# Altium schematic sheet Mixer.SchDoc
size 431 x 279 mm; Organization: ORGANIZATION; Address1: ADDRESS 1; Address2: ADDRESS 2; Address3: ADDRESS 3; Address4: ADDRESS 4; Revision: -; ENG_APP_DATE: --/--/--; DSN_APP_DATE: --/--/--; CHK_APP_DATE: --/--/--
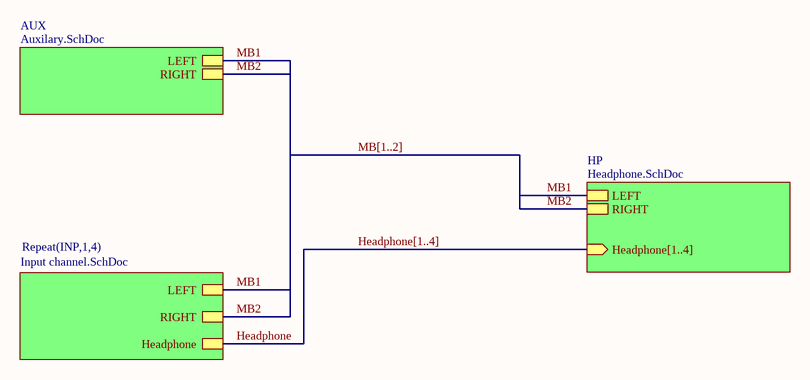
[diagram p0: Mixer.SchDoc]

## Sub-sheets
AUX = Auxilary.SchDoc: LEFT, RIGHT
HP = Headphone.SchDoc: Headphone[1..4] (in), LEFT, RIGHT
Repeat(INP,1,4) = Input channel.SchDoc: LEFT, RIGHT, Headphone

## Nets
Headphone: sheet Repeat(INP,1,4)/Headphone
MB1: sheet AUX/LEFT, sheet HP/LEFT, sheet Repeat(INP,1,4)/LEFT
MB2: sheet AUX/RIGHT, sheet HP/RIGHT, sheet Repeat(INP,1,4)/RIGHT

## Buses and harness runs
bus Headphone[1..4] = sheet HP/Headphone[1..4]
bus MB[1..2]

## Notes on the sheet
- DWG. NO.
- REV.
- SHT.
- THIS DOCUMENT AND THE DATA DISCLOSED HEREIN OR HEREWITH IS THE PROPERTY OF ALTIUM LIMITED AND MAY BE FREELY DISTRIBUTED IN WHOLE. NO RIGHTS ARE RESERVED OR EXPRESS OR IMPLIED WARANTEE GIVEN.
- REVISION
- DESCRIPTION
- DATE
- APPROVED
- ENG:
- DSN:
- APPROVALS
- PROJECT REVISION:
- www.altium.com <http://www.altium.com>
- DOCUMENT REVISION:
- 92037, La Jolla
- USA
- Altium Ltd.
- 4225 Executive Square
- CHK:
- REFERENCE DOCUMENTS
- DESIGN ITEM:
- TITLE
- VARIANT
- BOM:
- FAB DWG:
- PCB DWG:
- ASSY DWG:
- SCALE:
- SIZE
- B
- CAGE CODE
- FILE NAME
- DWG NO.
- SHEET
- OF
- REV